# Altium schematic sheet bq3DP_LCD.SchDoc: bq LCD
size A3; Author: Alvaro Hern /Juan Jose V; CompanyName: bq; Organization: bq - Mundo Reader; DocumentNumber: 1; Revision: 1.9; SheetNumber: 1; SheetTotal: 1; CurrentDate: August 26th, 2015
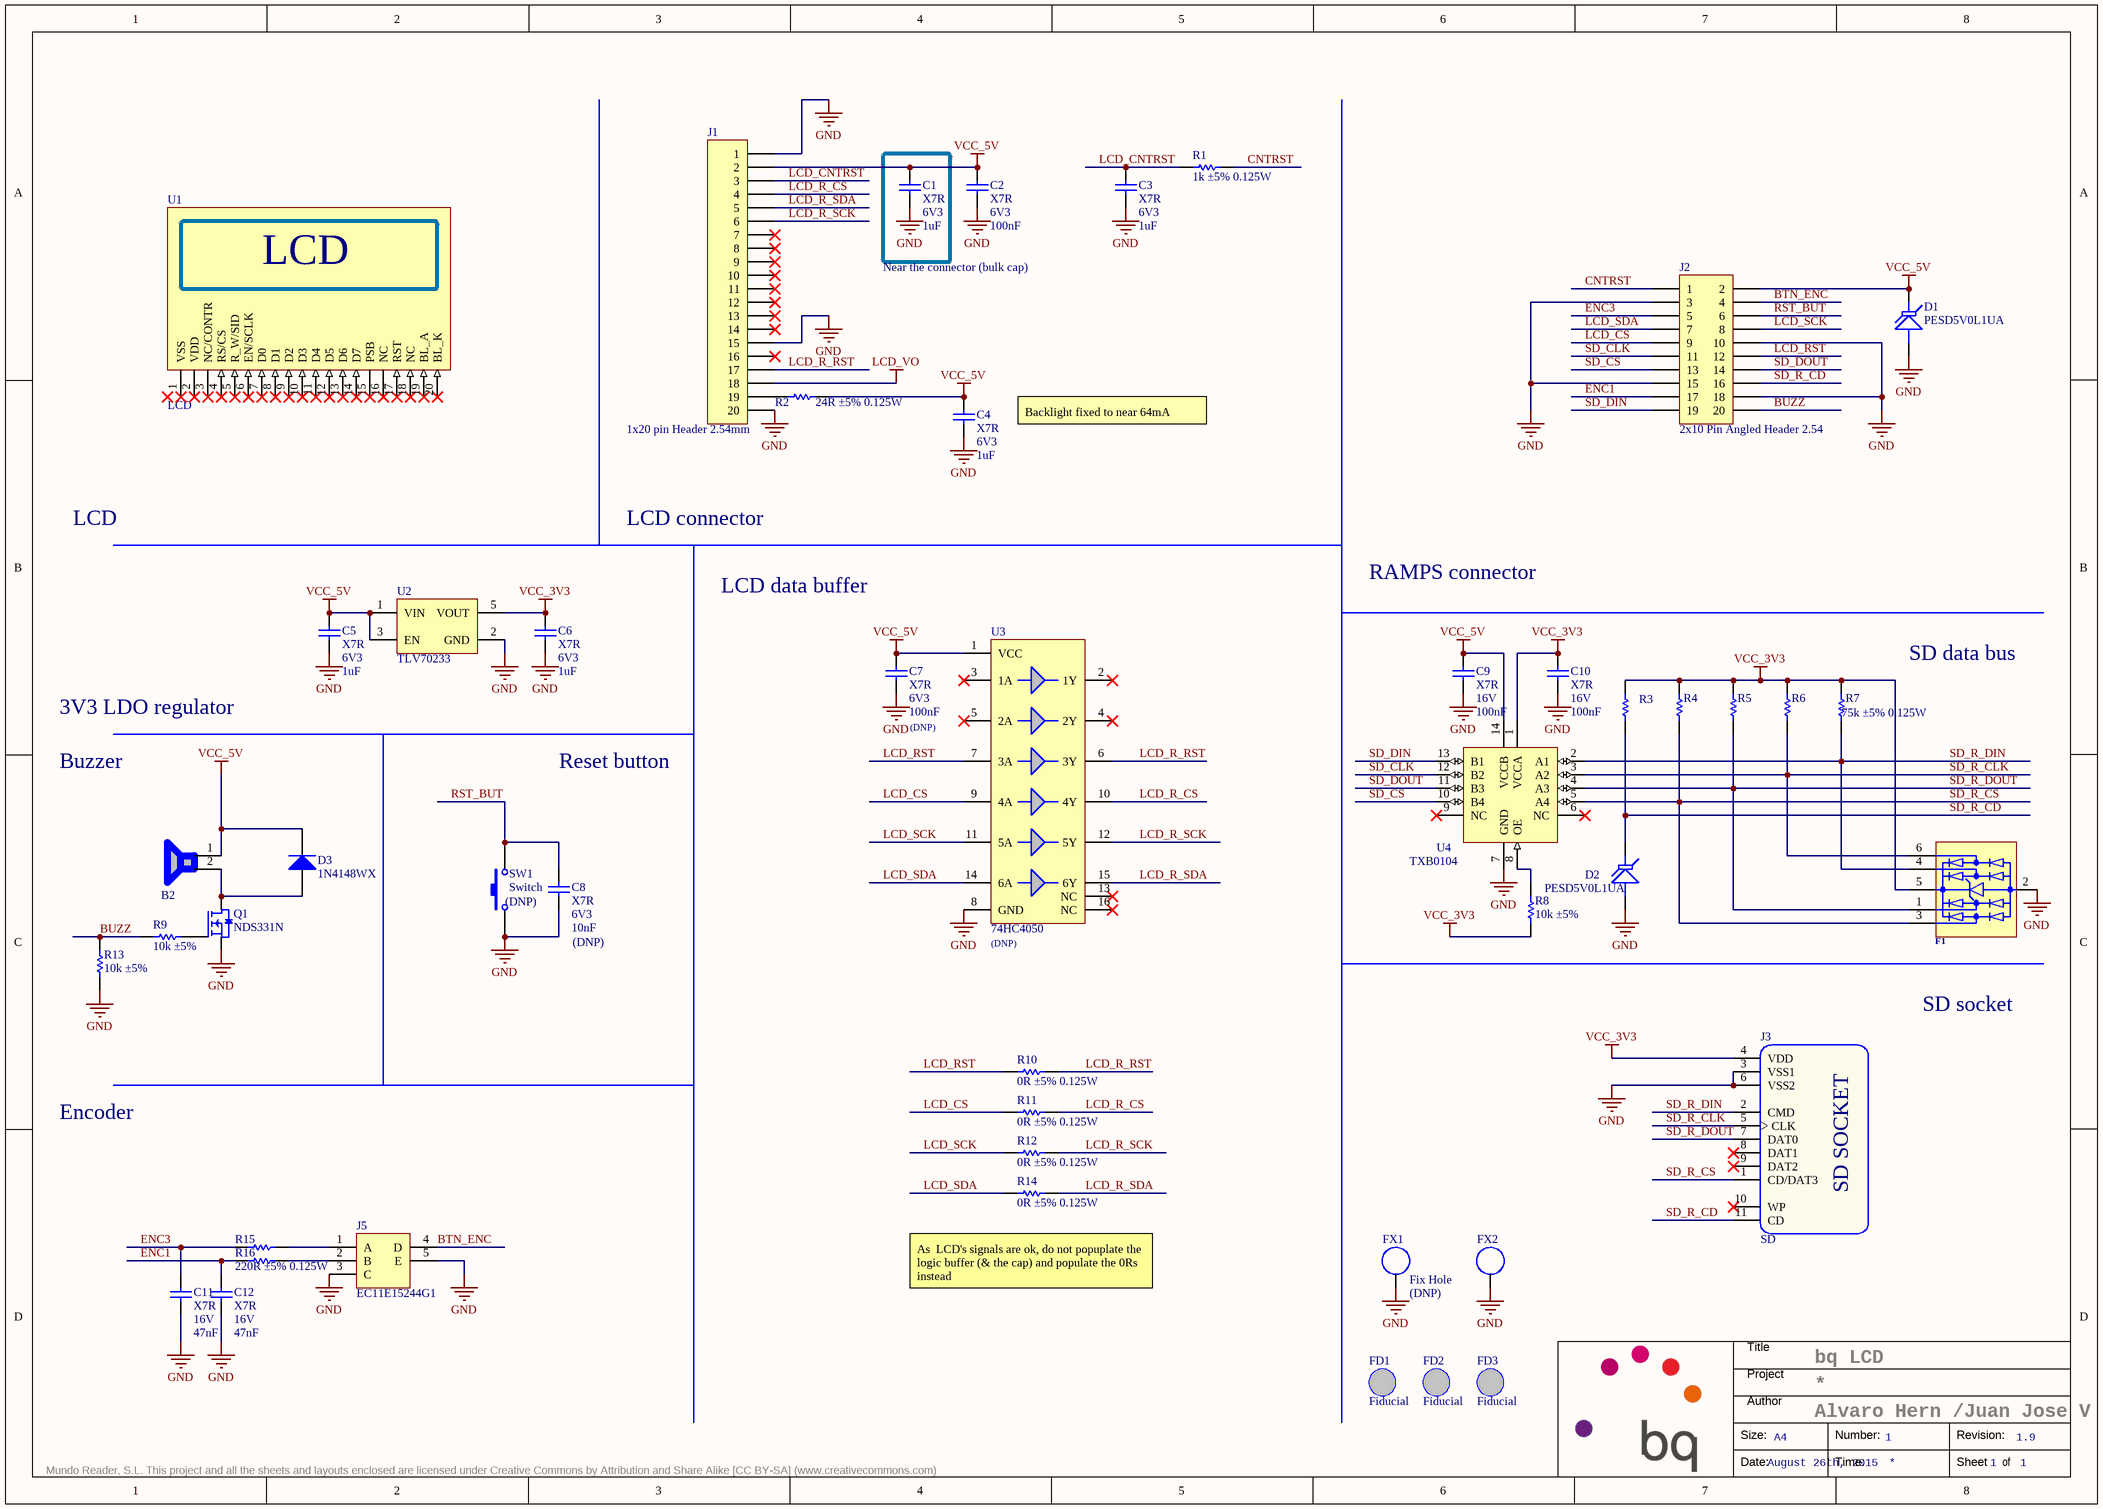
[diagram p0: bq3DP_LCD.SchDoc]

## Parts
B2  BUZZER  [KXG1205C]  (value not drawn)
C1  Dielectric: X7R  Voltage: 6V3  Capacitance: 1uF  [C0805]  (hidden comment: Capacitor)
C2  Dielectric: X7R  Voltage: 6V3  Capacitance: 100nF  [C0805]  (hidden comment: Capacitor)
C3  Dielectric: X7R  Voltage: 6V3  Capacitance: 1uF  [C0805]  (hidden comment: Capacitor)
C4  Dielectric: X7R  Voltage: 6V3  Capacitance: 1uF  [C0805]  (hidden comment: Capacitor)
C5  Dielectric: X7R  Voltage: 6V3  Capacitance: 1uF  [C0805]  (hidden comment: Capacitor)
C6  Dielectric: X7R  Voltage: 6V3  Capacitance: 1uF  [C0805]  (hidden comment: Capacitor)
C7  Dielectric: X7R  Voltage: 6V3  Capacitance: 100nF  Variant: (DNP)  [C0805]  (hidden comment: Capacitor)
C8  Dielectric: X7R  Voltage: 6V3  Capacitance: 10nF  Variant: (DNP)  [C0805]  (hidden comment: Capacitor)  (no BOM)
C9  Dielectric: X7R  Voltage: 16V  Capacitance: 100nF  [C0805]  (hidden comment: Capacitor)
C10  Dielectric: X7R  Voltage: 16V  Capacitance: 100nF  [C0805]  (hidden comment: Capacitor)
C11  Dielectric: X7R  Voltage: 16V  Capacitance: 47nF  [C0805]  (hidden comment: Capacitor)
C12  Dielectric: X7R  Voltage: 16V  Capacitance: 47nF  [C0805]  (hidden comment: Capacitor)
D1  PESD5V0L1UA  [SOD323]
D2  PESD5V0L1UA  [SOD323]
D3  1N4148WX  [SOD323]
F1  IP4220CZ6  [SOT23-6]  (value not drawn)
FD1  Fiducial  [Fiducial]  (no BOM)
FD2  Fiducial  [Fiducial]  (no BOM)
FD3  Fiducial  [Fiducial]  (no BOM)
FX1  Fix Hole  Variant: (DNP)  [74760045]  (no BOM)
FX2  Fix Hole  [7466214]  (value not drawn)  (no BOM)
J1  1x20 pin Header 2.54mm  [1x20 Pin Header 2.54]
J2  2x10 Pin Angled Header 2.54  [2x10 Pin Angled Header 2.54]
J3  SD  [SD]
J5  OrderingCode: EC11E15244G1  [Encoder_EC11]  (hidden comment: Encoder_ALPS)
Q1  NDS331N  [SOT23-3]
R1  value 1k ±5% 0.125W  [R0805]  (hidden comment: Resistor)
R2  value 24R ±5% 0.125W  [R0805]  (hidden comment: Resistor)
R3  Resistor  [R0805]  (value not drawn)
R4  Resistor  [R0805]  (value not drawn)
R5  Resistor  [R0805]  (value not drawn)
R6  Resistor  [R0805]  (value not drawn)
R7  value 75k ±5% 0.125W  [R0805]  (hidden comment: Resistor)
R8  value 10k ±5%  [R0805]  (hidden comment: Resistor)
R9  value 10k ±5%  [R0805]  (hidden comment: Resistor)
R10  value 0R ±5% 0.125W  [R0805]  (hidden comment: Resistor)
R11  value 0R ±5% 0.125W  [R0805]  (hidden comment: Resistor)
R12  value 0R ±5% 0.125W  [R0805]  (hidden comment: Resistor)
R13  value 10k ±5%  [R0805]  (hidden comment: Resistor)
R14  value 0R ±5% 0.125W  [R0805]  (hidden comment: Resistor)
R15  Resistor  [R0805]  (value not drawn)
R16  value 220R ±5% 0.125W  [R0805]  (hidden comment: Resistor)
SW1  Switch  Variant: (DNP)  [SW_SMD_6.0x3.8]  (no BOM)
U1  LCD  [LCD_Graphic_128x64]
U2  TLV70233  [SOT23-5]
U3  74HC4050  Variant: (DNP)  [SO16]  (no BOM)
U4  TXB0104  [QFN14]

## Nets
GND: C1.1 C2.1 C3.1 C4.1 C5.1 C6.1 C7.1 C8.1 C9.1 C10.1 C11.1 C12.1 D1.A D2.A F1.2 FX1.1 FX2.1 J1.1 J1.15 J1.20 J2.3 J2.10 J2.15 J2.18 J3.3(VSS1) J3.6(VSS2) J5.3(C) J5.5(E) Q1.2(S) R13.1 SW1.1 U2.2(GND) U3.8(GND) U4.7(GND)
LCD_VO: J1.18
VCC_3V3: C6.2 C10.2 F1.5 J3.4(VDD) R3.2 R4.2 R5.2 R6.2 R7.2 R8.2 U2.5(VOUT) U4.1(VCCA)
VCC_5V: B2.1 C1.2 C2.2 C4.2 C5.2 C7.2 C9.2 D1.K D3.K J1.2 J2.2 R2.2 U2.1(VIN) U2.3(EN) U3.1(VCC) U4.14(VCCB)
BTN_ENC: J2.4 J5.4(D)
BUZZ: J2.20 R9.2 R13.2
CNTRST: J2.1 R1.2
ENC1: C12.2 J2.17 R16.1
ENC3: C11.2 J2.5 R15.1
LCD_CNTRST: C3.2 J1.3 R1.1
LCD_CS: J2.9 R11.1 U3.9(4A)
LCD_R_CS: J1.4 R11.2 U3.10(4Y)
LCD_R_RST: J1.17 R10.2 U3.6(3Y)
LCD_R_SCK: J1.6 R12.2 U3.12(5Y)
LCD_R_SDA: J1.5 R14.2 U3.15(6Y)
LCD_RST: J2.12 R10.1 U3.7(3A)
LCD_SCK: J2.8 R12.1 U3.11(5A)
LCD_SDA: J2.7 R14.1 U3.14(6A)
RST_BUT: C8.2 J2.6 SW1.2
SD_CLK: J2.11 U4.12(B2)
SD_CS: J2.13 U4.10(B4)
SD_DIN: J2.19 U4.13(B1)
SD_DOUT: J2.14 U4.11(B3)
SD_R_CD: D2.K J2.16 J3.11(CD) R3.1
SD_R_CLK: F1.6 J3.5(CLK) R6.1 U4.3(A2)
SD_R_CS: F1.3 J3.1(CD/DAT3) R4.1 U4.5(A4)
SD_R_DIN: F1.4 J3.2(CMD) R7.1 U4.2(A1)
SD_R_DOUT: F1.1 J3.7(DAT0) R5.1 U4.4(A3)
NetB2_2: B2.2 D3.A Q1.3(D)
NetJ1_19: J1.19 R2.1
NetJ5_1: J5.1(A) R15.2
NetJ5_2: J5.2(B) R16.2
NetQ1_1: Q1.1(G) R9.1
NetR8_1: R8.1 U4.8(OE)

Not connected (* = marked no-connect by the designer): J1 7* 8* 9* 10* 11* 12* 13* 14* 16*; J3 8(DAT1)* 9(DAT2)* 10(WP)*; U1 1(VSS)* 2(VDD)* 3(NC/CONTR)* 4(RS/CS)* 5(R_W/SID)* 6(EN/SCLK)* 7(D0)* 8(D1)* 9(D2)* 10(D3)* 11(D4)* 12(D5)* 13(D6)* 14(D7)* 15(PSB)* 16(NC)* 17(RST)* 18(NC)* 19(BL_A)* 20(BL_K)*; U3 2(1Y)* 3(1A)* 4(2Y)* 5(2A)* 13(NC)* 16(NC)*; U4 6(NC)* 9(NC)*

## Notes on the sheet
- Near the connector (bulk cap)
- Backlight fixed to near 64mA
- LCD
- LCD connector
- RAMPS connector
- LCD data buffer
- 3V3 LDO regulator
- SD data bus
- Buzzer
- Reset button
- SD socket
- Encoder
- (near R14) As  LCD's signals are ok, do not popuplate the logic buffer (& the cap) and populate the 0Rs instead
- Title
- Project
- Size:
- Author
- A4
- Number:
- Revision:
- Mundo Reader, S.L. This project and all the sheets and layouts enclosed are licensed under Creative Commons by Attribution and Share Alike [CC BY-SA] (www.creativecommons.com)
- Date:
- Time:
- Sheet
- of
- (in symbol SD) SD SOCKET

## Library data of the parts
B2 = KXG1205C: Manufacturer: Kingstate Elect.; Temp_ Max: 70; Temp_ Min: -30; OrderingCode: KXG1205C; Part Number: KXG1205C
C1 C3-C6 = C0805_1uF_6V3_±10%: Manufacturer: Kemet; Value: 1uF ±10% 6V3; Tolerance: ±10%; OrderingCode: C0805C105K9RAC; Temp_ Max: 125; Temp_ Min: -55; Part Number: C0805_1uF_6V3_±10%
C2 C7 = C0805_100nF_6V3_±10%: Manufacturer: Kemet; Value: 100nF ±10% 6V3; Tolerance: ±10%; OrderingCode: C0805C104K9RAC; Temp_ Max: 125; Temp_ Min: -55; Part Number: C0805_100nF_6V3_±10%
C8 = C0805_10nF_6V3_±10%: Manufacturer: Kemet; Value: 10nF ±10% 6V3; Tolerance: ±10%; OrderingCode: C0805C103K9RAC; Temp_ Max: 125; Temp_ Min: -55; Part Number: C0805_10nF_6V3_±10%
C9 C10 = C0805_100nF_16V_±10%: Capacitor SMD; Manufacturer: Kemet; Value: 100nF ±10% 16V; Tolerance: ±10%; OrderingCode: C0805C104K4RAC; Temp_ Max: 125; Temp_ Min: -55; Part Number: C0805_100nF_16V_±10%
C11 C12 = C0805_47nF_16V_±10%: Capacitor SMD; Manufacturer: Kemet; Value: 47nF ±10% 16V; Tolerance: ±10%; OrderingCode: C0805C473K4RAC; Temp_ Max: 125; Temp_ Min: -55; Part Number: C0805_47nF_16V_±10%
D1 D2 = PESD5V0L1UA: Transient Suppression Diodes; Manufacturer: NXP; Voltage: 5Vdc; Breakdown Voltage: 6,4Vdc; Overvoltage Current: 3,5A; Temp_ Max: 150; Temp_ Min: -55; OrderingCode 2: ESD9L5.0ST5G; Part Number: PESD5V0L1UA; OrderingCode: PESD5V0L1UA; Manufacturer 2: ON
D3 = 1N4148WX: Diodo; Manufacturer: Micro Commercial Components; Ifor: 150mA; Vrrm: 100V; Ifsm: 2A; Vf: 1V; Temp_ Max: 150; Temp_ Min: -55; Value: 150mA 100V; Part Number: 1N4148WX; OrderingCode: 1N4148WX
F1 = USB ESD: USB Dual ESD Protection; Part Number: USB ESD; Manufacturer: NXP; Temp_ Max: 85; Temp_ Min: -40; OrderingCode: IP4220CZ6
FX1 = Earth connection: Manufacturer: Wurth; Temp_ Max: 85; Temp_ Min: -40; Part Number: Earth connection; OrderingCode: 74760045
FX2 = Earth SMD connection: Manufacturer: Wurth; Part Number: Earth SMD connection; OrderingCode: 7466214
J1 = CON_PH_THT2.54_20: Manufacturer: Samtec; OrderingCode: TSW-120-07-T-S; Temp_ Max: 125; Temp_ Min: -40; OrderingCode 2: 613 020 111 21; Value: 20; Part Number: CON_PH_THT2.54_20; Manufacturer 2: Würth Elektronik
J2 = CON_DPH_THTA2.54_20: 20 pin Dual Angled Header 2.54mm; Manufacturer: Samtec; OrderingCode: TSW-110-08-T-D-RA; Temp_ Max: 125; Temp_ Min: -40; Value: 20; OrderingCode 2: 613 020 210 21; Part Number: CON_DPH_THTA2.54_20; Manufacturer 2: Würth Elektronik
J3 = SD: Manufacturer: Wurth; OrderingCode: 693061010911; Temp_ Max: 85; Temp_ Min: -40; Value: SD socket; Part Number: SD
J5 = Encoder_EC11: Encoder 2-ph w/button ALPS; pin to pad: 1>A 2>B 3>C 4>D 5>E; Temp_ Max: 85; Temp_ Min: -40; OrderingCode 2: PEC11L-4220F-S0015; Manufacturer: ALPS; Part Number: Encoder_EC11; Manufacturer 2: Bourns
Q1 = NDS331N: Mosfet Channel N Enhancement Mode; Manufacturer: Fairchild Semiconductor; Vds: 20V; Vgss: 8V; Id: 1,3A; Temp_ Max: 150; Temp_ Min: -55; Part Number: NDS331N; OrderingCode: NDS331N
R1 = R0805_1k_0.125W_±5%: Manufacturer: Vishay; Tolerance: ±5%; OrderingCode: CRCW08051K00JN; Power: 0.125W; Resistance: 1k; Temp_ Max: 155; Temp_ Min: -55; PackageDescription: SMD; Part Number: R0805_1k_0.125W_±5%
R2 = R0805_24R_0.125W_±5%: Manufacturer: Vishay; Tolerance: ±5%; OrderingCode: CRCW080524R0JN; Power: 0.125W; Resistance: 24R; Temp_ Max: 155; Temp_ Min: -55; PackageDescription: SMD; Part Number: R0805_24R_0.125W_±5%
R3-R6 = R0805_75k_0.125W_±5%: Resistor, SMD; Manufacturer: Vishay; Tolerance: ±5%; OrderingCode: CRCW080575K0JN; Power: 0.125W; Value: 75k ±5% 0.125W; Resistance: 75k; Temp_ Max: 155; Temp_ Min: -55; PackageDescription: SMD; Part Number: R0805_75k_0.125W_±5%
R7 = R0805_75k_0.125W_±5%: Resistor, SMD; Manufacturer: Vishay; Tolerance: ±5%; OrderingCode: CRCW080575K0JN; Power: 0.125W; Resistance: 75k; Temp_ Max: 155; Temp_ Min: -55; PackageDescription: SMD; Part Number: R0805_75k_0.125W_±5%
R8 R9 R13 = R0805_10k_0.125W_±5%: Manufacturer: Vishay; Tolerance: ±5%; OrderingCode: CRCW080510K0JN; Power: 0.125W; Resistance: 10k; Temp_ Max: 155; Temp_ Min: -55; PackageDescription: SMD; Part Number: R0805_10k_0.125W_±5%
R10-R12 R14 = R0805_0R_0.125W_±5%: Resistor, SMD; Manufacturer: Vishay; Tolerance: ±5%; OrderingCode: CRCW08050000Z0; Power: 0.125W; Resistance: 0R; Temp_ Max: 155; Temp_ Min: -55; PackageDescription: SMD; Part Number: R0805_0R_0.125W_±5%
R15 = R0805_220R_0.125W_±5%: Resistor, SMD; Manufacturer: Vishay; Tolerance: ±5%; OrderingCode: CRCW0805220RJN; Power: 0.125W; Value: 220R ±5% 0.125W; Resistance: 220R; Temp_ Max: 155; Temp_ Min: -55; PackageDescription: SMD; Part Number: R0805_220R_0.125W_±5%
R16 = R0805_220R_0.125W_±5%: Resistor, SMD; Manufacturer: Vishay; Tolerance: ±5%; OrderingCode: CRCW0805220RJN; Power: 0.125W; Resistance: 220R; Temp_ Max: 155; Temp_ Min: -55; PackageDescription: SMD; Part Number: R0805_220R_0.125W_±5%
SW1 = SW SMD: Micro miniature pushbutton surface Switch; Part Number: SW SMD; Manufacturer: Würth Elektronik; OrderingCode: 434 121 025 816; Temp_ Max: 85; Temp_ Min: -40; OrderingCode 2: KSR231GLFS; Manufacturer 2: Cannon, ITT Industries
U1 = LCD_graph: LCD 128x64 dot 93x70mm; Manufacturer: Winstar; OrderingCode: WG12864U5-TFH-VB5#; Temp_ Max: 85; Temp_ Min: -20; Part Number: LCD_graph
U2 = TLV70233: 300mA LowIQ Low-dropout Regulator; Manufacturer: Texas Instruments; OrderingCode: TLV70233PDBV; Voltage IN: 2÷5,5 VDC; Voltage OUT: 1,2÷4,8 VDC; Temp_ Max: 125; Temp_ Min: -40; Part Number: TLV70233; Current OUT: 300 mA
U3 = HEF4050B: Hex non-inverting HIGH-to-LOW level shifter; Manufacturer: NXP; Temp_ Max: 85; Temp_ Min: -40; OrderingCode 2: 74HC4050D; Part Number: HEF4050B; OrderingCode: HEF4050B; Manufacturer 2: NXP
U4 = TXB0104: Voltage Translator, Quad; Manufacturer: Texas Instruments; OrderingCode: TXB0104RGYR; Temp_ Max: 85; Temp_ Min: -40; Part Number: TXB0104
FD1-FD3 = Fiducial: Part Number: Fiducial